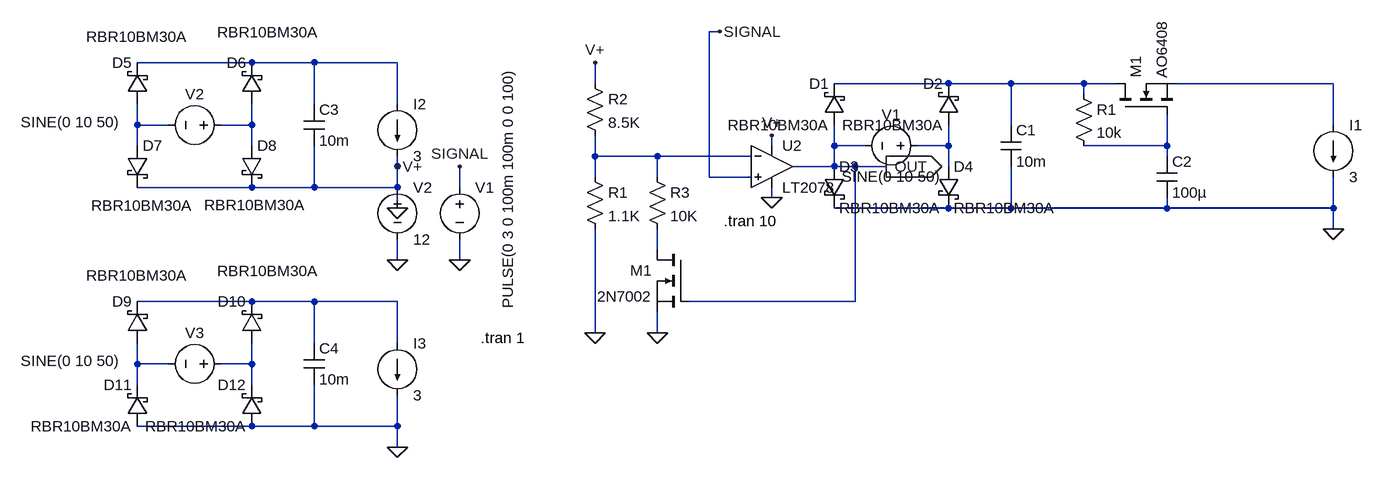
[diagram p0: schematic Draft2.asc]
Draft2.asc, the LTspice schematic file:
Version 4
<<<<<<< HEAD
SHEET 1 1060 680
WIRE -656 32 -832 32
WIRE -560 32 -656 32
WIRE -432 32 -560 32
WIRE 416 64 240 64
WIRE 512 64 416 64
WIRE 624 64 512 64
WIRE 672 64 624 64
WIRE 1008 64 768 64
WIRE 624 80 624 64
WIRE -560 96 -560 32
WIRE -432 96 -432 32
WIRE -832 128 -832 96
WIRE -784 128 -832 128
WIRE -656 128 -656 96
WIRE -656 128 -704 128
WIRE 512 128 512 64
WIRE 1008 128 1008 64
WIRE -832 160 -832 128
WIRE -656 160 -656 128
WIRE 240 160 240 128
WIRE 288 160 240 160
WIRE 416 160 416 128
WIRE 416 160 368 160
WIRE 752 160 752 112
WIRE 752 160 624 160
WIRE 752 176 752 160
WIRE 240 192 240 160
WIRE 416 192 416 160
WIRE -656 224 -832 224
WIRE -560 224 -560 160
WIRE -560 224 -656 224
WIRE -432 224 -432 176
WIRE -432 224 -560 224
WIRE -432 256 -432 224
WIRE 416 256 240 256
WIRE 512 256 512 192
WIRE 512 256 416 256
WIRE 752 256 752 240
WIRE 752 256 512 256
WIRE 1008 256 1008 208
WIRE 1008 256 752 256
WIRE 1008 288 1008 256
WIRE -656 400 -832 400
WIRE -560 400 -656 400
WIRE -432 400 -560 400
WIRE -560 464 -560 400
WIRE -432 464 -432 400
WIRE -832 496 -832 464
WIRE -784 496 -832 496
WIRE -656 496 -656 464
WIRE -656 496 -704 496
WIRE -832 528 -832 496
WIRE -656 528 -656 496
WIRE -656 592 -832 592
WIRE -560 592 -560 528
WIRE -560 592 -656 592
WIRE -432 592 -432 544
WIRE -432 592 -560 592
WIRE -432 624 -432 592
FLAG 1008 288 0
FLAG -432 256 0
FLAG -432 624 0
SYMBOL voltage 384 160 R90
WINDOW 0 -32 56 VBottom 2
WINDOW 3 32 56 VTop 2
WINDOW 123 0 0 Left 0
WINDOW 39 0 0 Left 0
SYMATTR InstName V1
SYMATTR Value SINE(0 10 50)
SYMBOL schottky 256 128 R180
WINDOW 0 24 64 Left 2
WINDOW 3 24 0 Left 2
SYMATTR InstName D1
SYMATTR Value RBR10BM30A
SYMATTR Description Diode
SYMATTR Type diode
SYMBOL schottky 432 128 R180
WINDOW 0 24 64 Left 2
WINDOW 3 24 0 Left 2
SYMATTR InstName D2
SYMATTR Value RBR10BM30A
SYMATTR Description Diode
SYMATTR Type diode
SYMBOL schottky 224 192 R0
SYMATTR InstName D3
SYMATTR Value RBR10BM30A
SYMATTR Description Diode
SYMATTR Type diode
SYMBOL schottky 400 192 R0
SYMATTR InstName D4
SYMATTR Value RBR10BM30A
SYMATTR Description Diode
SYMATTR Type diode
SYMBOL cap 496 128 R0
SYMATTR InstName C1
SYMATTR Value 10m
SYMBOL current 1008 128 R0
WINDOW 123 0 0 Left 0
WINDOW 39 0 0 Left 0
SYMATTR InstName I1
SYMATTR Value 3
SYMBOL res 608 64 R0
SYMATTR InstName R1
SYMATTR Value 10k
SYMBOL cap 736 176 R0
SYMATTR InstName C2
SYMATTR Value 100µ
SYMBOL nmos 672 112 R270
SYMATTR InstName M1
SYMATTR Value AO6408
SYMBOL voltage -688 128 R90
WINDOW 0 -32 56 VBottom 2
WINDOW 3 -20 247 VTop 2
WINDOW 123 0 0 Left 0
WINDOW 39 0 0 Left 0
SYMATTR InstName V2
SYMATTR Value SINE(0 10 50)
SYMBOL schottky -816 96 R180
WINDOW 0 24 64 Left 2
WINDOW 3 -61 104 Left 2
SYMATTR InstName D5
SYMATTR Value RBR10BM30A
SYMATTR Description Diode
SYMATTR Type diode
SYMBOL schottky -640 96 R180
WINDOW 0 24 64 Left 2
WINDOW 3 -87 111 Left 2
SYMATTR InstName D6
SYMATTR Value RBR10BM30A
SYMATTR Description Diode
SYMATTR Type diode
SYMBOL schottky -848 160 R0
WINDOW 3 -55 92 Left 2
SYMATTR InstName D7
SYMATTR Value RBR10BM30A
SYMATTR Description Diode
SYMATTR Type diode
SYMBOL schottky -672 160 R0
WINDOW 3 -57 91 Left 2
SYMATTR InstName D8
SYMATTR Value RBR10BM30A
SYMATTR Description Diode
SYMATTR Type diode
SYMBOL cap -576 96 R0
SYMATTR InstName C3
SYMATTR Value 10m
SYMBOL current -432 96 R0
WINDOW 123 0 0 Left 0
WINDOW 39 0 0 Left 0
SYMATTR InstName I2
SYMATTR Value 3
SYMBOL voltage -688 496 R90
WINDOW 0 -32 56 VBottom 2
WINDOW 3 -20 247 VTop 2
WINDOW 123 0 0 Left 0
WINDOW 39 0 0 Left 0
SYMATTR InstName V3
SYMATTR Value SINE(0 10 50)
SYMBOL schottky -816 464 R180
WINDOW 0 24 64 Left 2
WINDOW 3 -61 104 Left 2
SYMATTR InstName D9
SYMATTR Value RBR10BM30A
SYMATTR Description Diode
SYMATTR Type diode
SYMBOL schottky -640 464 R180
WINDOW 0 24 64 Left 2
WINDOW 3 -87 111 Left 2
SYMATTR InstName D10
SYMATTR Value RBR10BM30A
SYMATTR Description Diode
SYMATTR Type diode
SYMBOL schottky -816 592 R180
WINDOW 0 24 64 Left 2
WINDOW 3 24 0 Left 2
SYMATTR InstName D11
SYMATTR Value RBR10BM30A
SYMATTR Description Diode
SYMATTR Type diode
SYMBOL schottky -640 592 R180
WINDOW 0 24 64 Left 2
WINDOW 3 24 0 Left 2
SYMATTR InstName D12
SYMATTR Value RBR10BM30A
SYMATTR Description Diode
SYMATTR Type diode
SYMBOL cap -576 464 R0
SYMATTR InstName C4
SYMATTR Value 10m
SYMBOL current -432 464 R0
WINDOW 123 0 0 Left 0
WINDOW 39 0 0 Left 0
SYMATTR InstName I3
SYMATTR Value 3
TEXT 70 276 Left 2 !.tran 10
=======
SHEET 1 880 680
WIRE 64 -16 48 -16
WIRE -128 64 -128 32
WIRE 144 160 144 144
WIRE -128 176 -128 144
WIRE -32 176 -128 176
WIRE 112 176 -32 176
WIRE 272 192 176 192
WIRE 320 192 272 192
WIRE -128 208 -128 176
WIRE -32 208 -32 176
WIRE 48 208 48 -16
WIRE 112 208 48 208
WIRE -432 224 -432 192
WIRE -336 224 -336 192
WIRE 144 240 144 224
WIRE -32 320 -32 288
WIRE -432 336 -432 304
WIRE -336 336 -336 304
WIRE 272 400 272 192
WIRE 272 400 16 400
WIRE -128 448 -128 288
WIRE -32 448 -32 416
FLAG -128 448 0
FLAG -432 336 0
FLAG -432 192 V+
FLAG 144 144 V+
FLAG -128 32 V+
FLAG -336 192 SIGNAL
FLAG 64 -16 SIGNAL
FLAG -336 336 0
FLAG -32 448 0
FLAG 320 192 OUT
IOPIN 320 192 Out
FLAG 144 240 0
SYMBOL res -144 192 R0
SYMATTR InstName R1
SYMATTR Value 1.1K
SYMBOL res -144 48 R0
SYMATTR InstName R2
SYMATTR Value 8.5K
SYMBOL voltage -336 208 R0
WINDOW 123 0 0 Left 2
WINDOW 39 0 0 Left 2
WINDOW 3 74 -168 VRight 2
SYMATTR InstName V1
SYMATTR Value PULSE(0 3 0 100m 100m 0 0 100)
SYMBOL voltage -432 208 R0
WINDOW 123 0 0 Left 2
WINDOW 39 0 0 Left 2
SYMATTR InstName V2
SYMATTR Value 12
SYMBOL nmos 16 320 M0
SYMATTR InstName M1
SYMATTR Value 2N7002
SYMBOL res -48 192 R0
SYMATTR InstName R3
SYMATTR Value 10K
SYMBOL Opamps\\LT2078 144 128 R0
SYMATTR InstName U2
TEXT -304 456 Left 2 !.tran 1
>>>>>>> 6c758090dd1eeeb20fed47f8386ac39ac4c47e26

The netlist it stands for:
* Draft2.asc
V1 N006 OUT SINE(0 10 50)
D1 OUT N002 RBR10BM30A
D2 N006 N002 RBR10BM30A
D3 OUT 0 RBR10BM30A
D4 N006 0 RBR10BM30A
C1 N002 0 10m
I1 N003 0 3
R1 N002 N007 10k
C2 N007 0 100µ
M1 N002 N007 N003 N003 AO6408
V2 N005 N004 SINE(0 10 50)
D5 N004 N001 RBR10BM30A
D6 N005 N001 RBR10BM30A
D7 N004 0 RBR10BM30A
D8 N005 0 RBR10BM30A
C3 N001 0 10m
I2 N001 0 3
V3 N010 N009 SINE(0 10 50)
D9 N009 N008 RBR10BM30A
D10 N010 N008 RBR10BM30A
D11 0 N009 RBR10BM30A
D12 0 N010 RBR10BM30A
C4 N008 0 10m
I3 N008 0 3
R1 N011 0 1.1K
R2 0 N011 8.5K
V1 SIGNAL 0 PULSE(0 3 0 100m 100m 0 0 100)
V2 0 0 12
M1 N012 OUT 0 0 2N7002
R3 N011 N012 10K
XU2 SIGNAL N011 0 0 OUT LT2078  ; pins In+ In- V+ V- OUT
.model D D
.lib standard.dio
.model NMOS NMOS
.model PMOS PMOS
.lib standard.mos
.tran 10
.tran 1
.backanno
.end